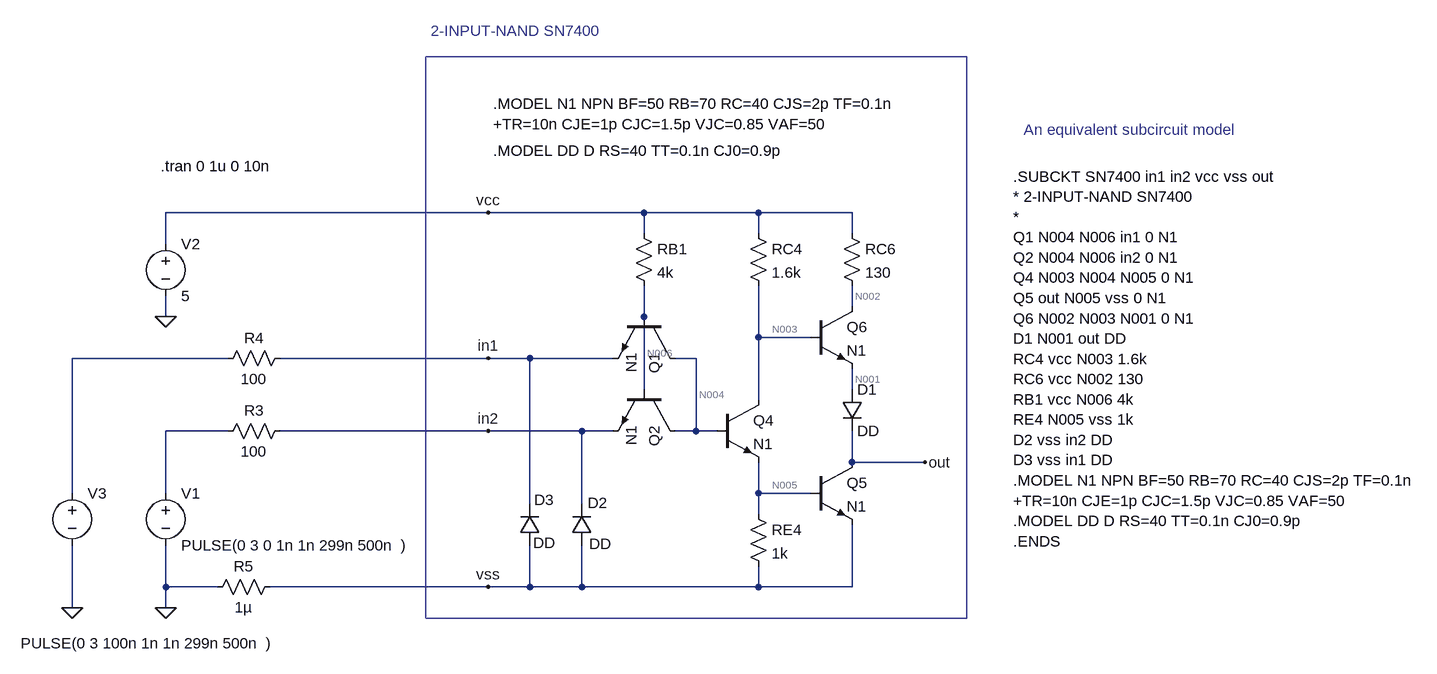
[diagram p0: schematic SN7400_test1.asc]
SN7400_test1.asc, the LTspice schematic file:
Version 4
SHEET 1 1348 728
WIRE 400 240 400 208
WIRE 400 304 400 352
WIRE 400 112 400 80
WIRE 336 160 256 160
WIRE 256 160 256 256
WIRE 192 304 160 304
WIRE 256 352 256 400
WIRE 256 400 336 400
WIRE 400 448 400 544
WIRE 80 240 80 128
WIRE 80 128 80 80
WIRE 128 192 160 192
WIRE 160 192 160 304
WIRE 160 304 128 304
WIRE 32 192 -96 192
WIRE 32 304 -16 304
WIRE 256 160 256 80
WIRE 80 0 80 -32
WIRE 80 -32 256 -32
WIRE 400 -32 400 0
WIRE 256 0 256 -32
WIRE 256 -32 400 -32
WIRE 256 400 256 432
WIRE 256 512 256 544
WIRE 256 544 400 544
WIRE 256 544 -16 544
WIRE 400 352 512 352
WIRE -160 -32 80 -32
WIRE -16 304 -160 304
WIRE -96 192 -160 192
WIRE -656 576 -656 544
WIRE -560 304 -656 304
WIRE -656 304 -656 400
WIRE -656 480 -656 544
WIRE -656 -32 -656 16
WIRE -656 96 -656 128
WIRE -560 192 -800 192
WIRE -160 192 -480 192
WIRE -160 -32 -656 -32
WIRE -160 304 -480 304
WIRE -160 544 -496 544
WIRE -576 544 -656 544
WIRE -16 416 -16 304
WIRE -96 416 -96 192
WIRE -96 480 -96 544
WIRE -16 544 -96 544
WIRE -16 480 -16 544
WIRE -96 544 -160 544
WIRE -800 576 -800 480
WIRE -800 192 -800 400
FLAG -656 576 0
FLAG -656 128 0
FLAG 512 352 out
FLAG -160 192 in1
FLAG -160 304 in2
FLAG -160 -32 vcc
FLAG -160 544 vss
FLAG -800 576 0
SYMBOL npn 128 128 R90
SYMATTR InstName Q1
SYMATTR Value N1
SYMBOL npn 192 256 R0
SYMATTR InstName Q4
SYMATTR Value N1
SYMBOL npn 336 352 R0
SYMATTR InstName Q5
SYMATTR Value N1
SYMBOL npn 336 112 R0
SYMATTR InstName Q6
SYMATTR Value N1
SYMBOL diode 384 240 R0
SYMATTR InstName D1
SYMATTR Value DD
SYMBOL res 240 -16 R0
SYMATTR InstName RC4
SYMATTR Value 1.6k
SYMBOL res 384 -16 R0
SYMATTR InstName RC6
SYMATTR Value 130
SYMBOL res 64 -16 R0
SYMATTR InstName RB1
SYMATTR Value 4k
SYMBOL res 240 416 R0
SYMATTR InstName RE4
SYMATTR Value 1k
SYMBOL npn 128 240 R90
SYMATTR InstName Q2
SYMATTR Value N1
SYMBOL voltage -656 384 R0
WINDOW 123 0 0 Left 0
WINDOW 39 0 0 Left 0
SYMATTR InstName V1
SYMATTR Value PULSE(0 3 0 1n 1n 299n 500n  )
SYMBOL res -576 320 R270
WINDOW 0 32 56 VTop 0
WINDOW 3 0 56 VBottom 0
SYMATTR InstName R3
SYMATTR Value 100
SYMBOL voltage -656 0 R0
SYMATTR InstName V2
SYMATTR Value 5
SYMBOL res -576 208 R270
WINDOW 0 32 56 VTop 0
WINDOW 3 0 56 VBottom 0
SYMATTR InstName R4
SYMATTR Value 100
SYMBOL res -592 560 R270
WINDOW 0 32 56 VTop 0
WINDOW 3 0 56 VBottom 0
SYMATTR InstName R5
SYMATTR Value 1µ
SYMBOL diode 0 480 R180
WINDOW 0 -24 65 Left 0
WINDOW 3 -30 2 Left 0
SYMATTR InstName D2
SYMATTR Value DD
SYMBOL diode -80 480 R180
WINDOW 0 -22 70 Left 0
WINDOW 3 -24 4 Left 0
SYMATTR InstName D3
SYMATTR Value DD
SYMBOL voltage -800 384 R0
WINDOW 123 0 0 Left 0
WINDOW 39 0 0 Left 0
WINDOW 3 -79 247 Left 0
SYMATTR InstName V3
SYMATTR Value PULSE(0 3 100n 1n 1n 299n 500n  )
TEXT -152 -200 Left 0 !.MODEL N1 NPN BF=50 RB=70 RC=40 CJS=2p TF=0.1n\n+TR=10n CJE=1p CJC=1.5p VJC=0.85 VAF=50
TEXT -152 -128 Left 0 !.MODEL DD D RS=40 TT=0.1n CJ0=0.9p
TEXT -664 -104 Left 0 !.tran 0 1u 0 10n
TEXT -248 -312 Left 0 ;2-INPUT-NAND SN7400
TEXT 648 -88 Left 0 !.SUBCKT SN7400 in1 in2 vcc vss out\n* 2-INPUT-NAND SN7400\n*\nQ1 N004 N006 in1 0 N1\nQ2 N004 N006 in2 0 N1\nQ4 N003 N004 N005 0 N1\nQ5 out N005 vss 0 N1\nQ6 N002 N003 N001 0 N1\nD1 N001 out DD\nRC4 vcc N003 1.6k\nRC6 vcc N002 130\nRB1 vcc N006 4k\nRE4 N005 vss 1k\nD2 vss in2 DD\nD3 vss in1 DD\n.MODEL N1 NPN BF=50 RB=70 RC=40 CJS=2p TF=0.1n\n+TR=10n CJE=1p CJC=1.5p VJC=0.85 VAF=50\n.MODEL DD D RS=40 TT=0.1n CJ0=0.9p\n.ENDS
TEXT 664 -160 Left 0 ;An equivalent subcircuit model
RECTANGLE Normal 576 592 -256 -272

The netlist it stands for:
* SN7400_test1.asc
Q1 N004 N006 in1 0 N1
Q4 N003 N004 N005 0 N1
Q5 out N005 vss 0 N1
Q6 N002 N003 N001 0 N1
D1 N001 out DD
RC4 vcc N003 1.6k
RC6 vcc N002 130
RB1 vcc N006 4k
RE4 N005 vss 1k
Q2 N004 N006 in2 0 N1
V1 N007 0 PULSE(0 3 0 1n 1n 299n 500n  )
R3 N007 in2 100
V2 vcc 0 5
R4 N008 in1 100
R5 0 vss 1µ
D2 vss in2 DD
D3 vss in1 DD
V3 N008 0 PULSE(0 3 100n 1n 1n 299n 500n  )
.model D D
.lib standard.dio
.model NPN NPN
.model PNP PNP
.lib standard.bjt
.MODEL N1 NPN BF=50 RB=70 RC=40 CJS=2p TF=0.1n
+TR=10n CJE=1p CJC=1.5p VJC=0.85 VAF=50
.MODEL DD D RS=40 TT=0.1n CJ0=0.9p
.tran 0 1u 0 10n
* 2-INPUT-NAND SN7400
.SUBCKT SN7400 in1 in2 vcc vss out
* 2-INPUT-NAND SN7400
*
Q1 N004 N006 in1 0 N1
Q2 N004 N006 in2 0 N1
Q4 N003 N004 N005 0 N1
Q5 out N005 vss 0 N1
Q6 N002 N003 N001 0 N1
D1 N001 out DD
RC4 vcc N003 1.6k
RC6 vcc N002 130
RB1 vcc N006 4k
RE4 N005 vss 1k
D2 vss in2 DD
D3 vss in1 DD
.MODEL N1 NPN BF=50 RB=70 RC=40 CJS=2p TF=0.1n
+TR=10n CJE=1p CJC=1.5p VJC=0.85 VAF=50
.MODEL DD D RS=40 TT=0.1n CJ0=0.9p
.ENDS
* An equivalent subcircuit model
.backanno
.end